# Altium schematic sheet Main.SchDoc
size A4; SheetNumber: 2; SheetTotal: 7
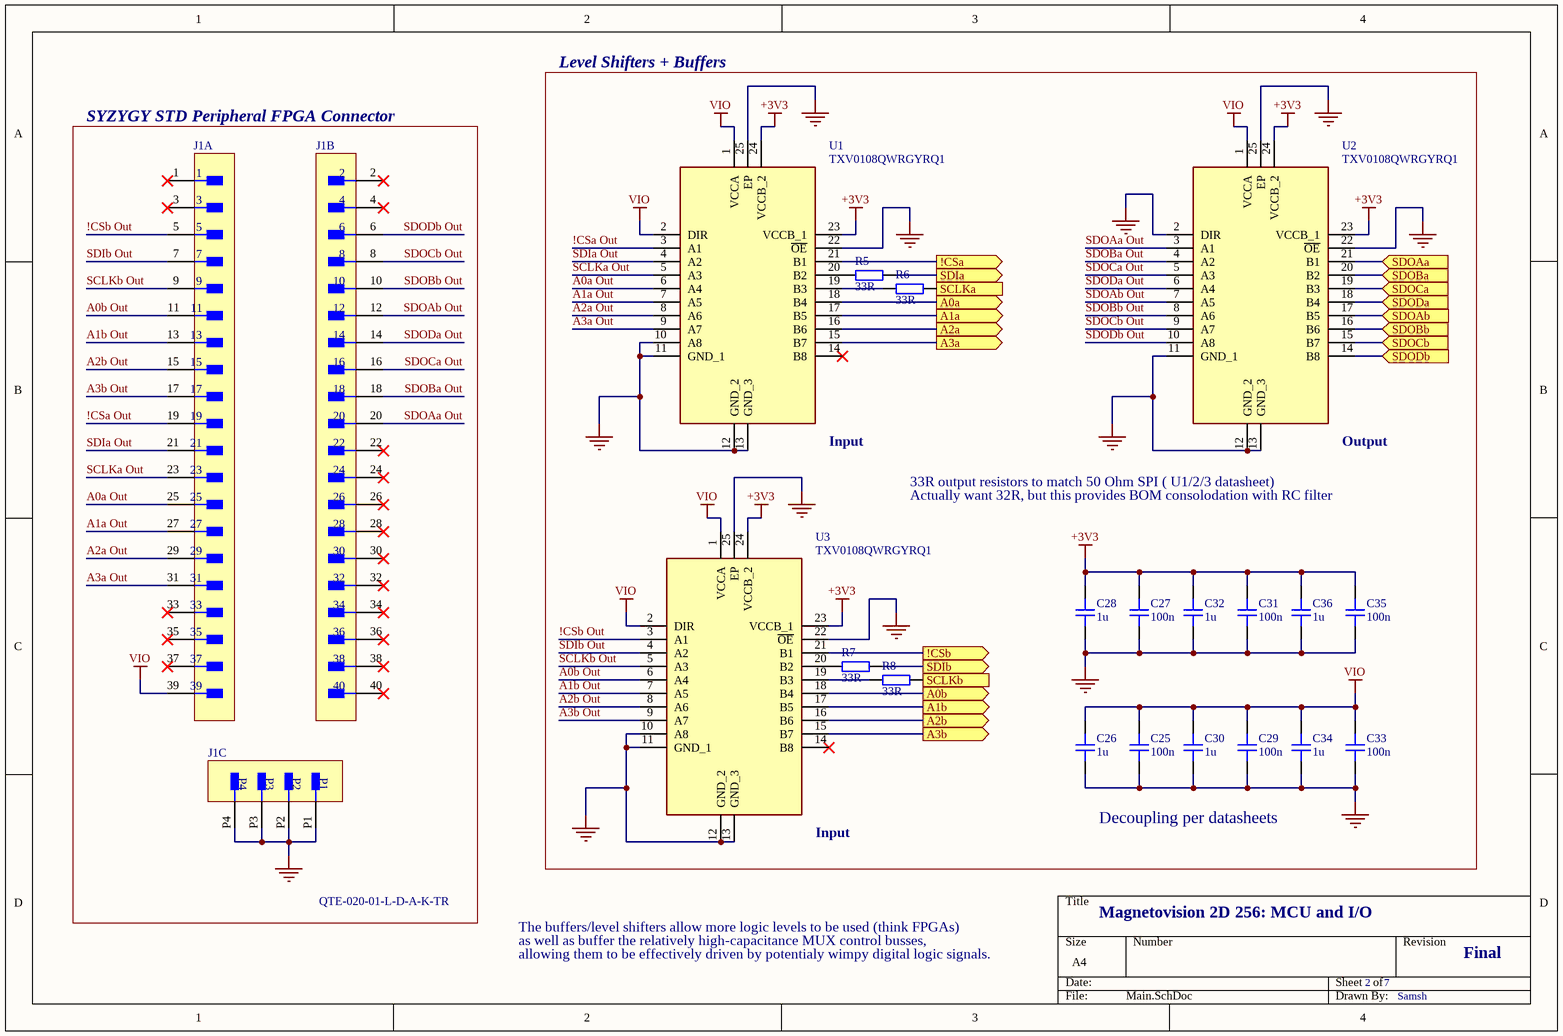
[diagram p0: Main.SchDoc]

## Parts
C25  100n  [CAP_0603]
C26  1u  [CAP_0603]
C27  100n  [CAP_0603]
C28  1u  [CAP_0603]
C29  100n  [CAP_0603]
C30  1u  [CAP_0603]
C31  100n  [CAP_0603]
C32  1u  [CAP_0603]
C33  100n  [CAP_0603]
C34  1u  [CAP_0603]
C35  100n  [CAP_0603]
C36  1u  [CAP_0603]
J1  QTE-020-01-L-D-A-K-TR  [FP-QTE-020-01-L-D-A-K-TR_MFG]  (value not drawn)  (parts A,B,C of 3)
R5  33R  [RES_0603]
R6  33R  [RES_0603]
R7  33R  [RES_0603]
R8  33R  [RES_0603]
U1  TXV0108QWRGYRQ1  [TXV0108QWRGYRQ1]
U2  TXV0108QWRGYRQ1  [TXV0108QWRGYRQ1]
U3  TXV0108QWRGYRQ1  [TXV0108QWRGYRQ1]

## Blocks framed on the sheet
SYZYGY STD Peripheral FPGA Connector: J1

## Ports
!CSa (out, see Master[2B]), !CSb (out, see Master[2B]), A0a (out, see Master[2C]), A0b (out, see Master[2C]), A1a (out, see Master[2C]), A1b (out, see Master[2C]), A2a (out, see Master[2C]), A2b (out, see Master[2C]), A3a (out, see Master[2D]), A3b (out, see Master[2D]), SCLKa (out, see Master[2B]), SCLKb (out, see Master[2B]), SDIa (out, see Master[2B]), SDIb (out, see Master[2B]), SDOAa (in, see Master[2C]), SDOAb (in, see Master[2C]), SDOBa (in, see Master[2C]), SDOBb (in, see Master[2C]), SDOCa (in, see Master[2C]), SDOCb (in, see Master[2C]), SDODa (in, see Master[2C]), SDODb (in, see Master[2C])

## Nets
+3V3: C27.2 C28.2 C31.2 C32.2 C35.2 C36.2 U1.23(VCCB_1) U1.24(VCCB_2) U2.23(VCCB_1) U2.24(VCCB_2) U3.23(VCCB_1) U3.24(VCCB_2)
GND: C25.1 C26.1 C27.1 C28.1 C29.1 C30.1 C31.1 C32.1 C33.1 C34.1 C35.1 C36.1 J1.P1 J1.P2 J1.P3 J1.P4 U1.10(A8) U1.11(GND_1) U1.12(GND_2) U1.13(GND_3) U1.22(~{OE}) U1.25(EP) U2.2(DIR) U2.11(GND_1) U2.12(GND_2) U2.13(GND_3) U2.22(~{OE}) U2.25(EP) U3.10(A8) U3.11(GND_1) U3.12(GND_2) U3.13(GND_3) U3.22(~{OE}) U3.25(EP)
VIO: C25.2 C26.2 C29.2 C30.2 C33.2 C34.2 J1.39 U1.1(VCCA) U1.2(DIR) U2.1(VCCA) U3.1(VCCA) U3.2(DIR)
!CSa: U1.21(B1) ; port !CSa
!CSa Out: J1.19 U1.3(A1)
!CSb: U3.21(B1) ; port !CSb
!CSb Out: J1.5 U3.3(A1)
A0a: U1.18(B4) ; port A0a
A0a Out: J1.25 U1.6(A4)
A0b: U3.18(B4) ; port A0b
A0b Out: J1.11 U3.6(A4)
A1a: U1.17(B5) ; port A1a
A1a Out: J1.27 U1.7(A5)
A1b: U3.17(B5) ; port A1b
A1b Out: J1.13 U3.7(A5)
A2a: U1.16(B6) ; port A2a
A2a Out: J1.29 U1.8(A6)
A2b: U3.16(B6) ; port A2b
A2b Out: J1.15 U3.8(A6)
A3a: U1.15(B7) ; port A3a
A3a Out: J1.31 U1.9(A7)
A3b: U3.15(B7) ; port A3b
A3b Out: J1.17 U3.9(A7)
SCLKa: R6.1 ; port SCLKa
SCLKa Out: J1.23 U1.5(A3)
SCLKb: R8.1 ; port SCLKb
SCLKb Out: J1.9 U3.5(A3)
SDIa: R5.1 ; port SDIa
SDIa Out: J1.21 U1.4(A2)
SDIb: R7.1 ; port SDIb
SDIb Out: J1.7 U3.4(A2)
SDOAa: U2.21(B1) ; port SDOAa
SDOAa Out: J1.20 U2.3(A1)
SDOAb: U2.17(B5) ; port SDOAb
SDOAb Out: J1.12 U2.7(A5)
SDOBa: U2.20(B2) ; port SDOBa
SDOBa Out: J1.18 U2.4(A2)
SDOBb: U2.16(B6) ; port SDOBb
SDOBb Out: J1.10 U2.8(A6)
SDOCa: U2.19(B3) ; port SDOCa
SDOCa Out: J1.16 U2.5(A3)
SDOCb: U2.15(B7) ; port SDOCb
SDOCb Out: J1.8 U2.9(A7)
SDODa: U2.18(B4) ; port SDODa
SDODa Out: J1.14 U2.6(A4)
SDODb: U2.14(B8) ; port SDODb
SDODb Out: J1.6 U2.10(A8)
NetR5_2: R5.2 U1.20(B2)
NetR6_2: R6.2 U1.19(B3)
NetR7_2: R7.2 U3.20(B2)
NetR8_2: R8.2 U3.19(B3)

Not connected (* = marked no-connect by the designer): J1 1* 2* 3* 4* 22* 24* 26* 28* 30* 32* 33* 34* 35* 36* 37* 38* 40*; U1 14(B8)*; U3 14(B8)*

## Notes on the sheet
- Level Shifters + Buffers
- (near U1) Input
- (near U2) Output
- (near U2) 33R output resistors to match 50 Ohm SPI ( U1/2/3 datasheet)
- Actually want 32R, but this provides BOM consolodation with RC filter
- (near U3) Input
- Decoupling per datasheets
- Magnetovision 2D 256: MCU and I/O
- The buffers/level shifters allow more logic levels to be used (think FPGAs)
- as well as buffer the relatively high-capacitance MUX control busses,
- allowing them to be effectively driven by potentialy wimpy digital logic signals.
- 2
- 7
- Final
- Samsh

## Library data of the parts
C25-C36 = CMP-001-00085-1: Capacitor SMD 0603; Distributor Link: *; LCSC: *; Design Item ID: CAP_0603; Rating: *; Source: Schematic-Lib-PhilsLab.SchLib; Manufacturer Part Number: *; Manufacturer: *; Dielectric: *
J1 = CMP-00575-09351342-1: Board to Board & Mezzanine Connectors Q Strip High-Speed Ground Plane Header, 0.80mm Pitch; Manufacturer Lifecycle Status: PRODUCTION; Voltage Rating (AC): 225V; Row Spacing: 3.94mm; Number of Contacts: 40; Gender: Male; Pitch: 800µm; Current Rating: 2A; ComponentLink3Description: Package URL; Lifecycle Status: Production; Min Operating Temperature: -55°C; Housing Material: Polymer; ComponentLink2Description: Datasheet URL; Insulation Material: Polyester; ComponentLink2URL: https://suddendocs.samtec.com/catalog_english/qte.pdf; Housing Color: Black; Voltage Rating: 225V; ComponentLink3URL: https://suddendocs.samtec.com/prints/qte-xxx-xx-xxx-d-xxx-footprint.pdf; Depth: 5.97mm; Number of Rows: 2; ComponentLink1Description: Manufacturer URL; Radiation Hardening: No; Length: 20mm; Mount: Surface Mount; Max Voltage Rating (AC): 225V; Orientation: Straight; Max Operating Temperature: 125°C; REACH SVHC: No SVHC; Contact Material: Gold, Nickel; Termination: Solder; ComponentLink1URL: http://www.samtec.com/; Height: 4.347mm; RoHS: Compliant; Contact Plating: Gold
R5-R8 = CMP-009-00179-1: Resistor SMD 0603; Manufacturer Part Number: *; Distributor Link: *; Source: Schematic-Lib-PhilsLab.SchLib; Manufacturer: *; Design Item ID: RES_0603; LCSC: *
U1-U3 = TXV0108QWRGYRQ1: Integrated Circuit; Manufacturer_Name: Texas Instruments; Datasheet Link: https://www.ti.com/lit/ds/symlink/txv0108-q1.pdf?ts=1721444850822&ref_url=https%253A%252F%252Fwww.mouser.cn%252F; Height: 1mm; Manufacturer_Part_Number: TXV0108QWRGYRQ1